# EAGLE design Bell (EAGLE 7.5.0)
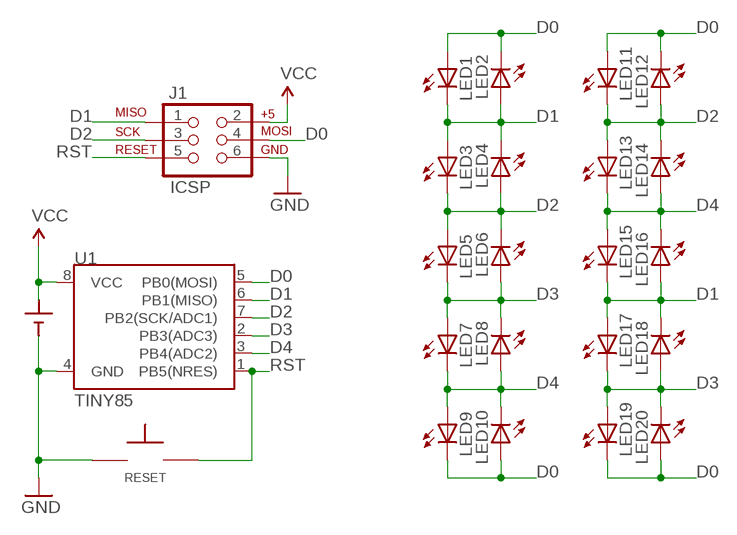
[diagram p0: schematic, sheet 1]

## Parts
BATT  CR2032  BATTCR2032_THRU  [CR2032-THRU]
J1  ICSP  AVR_SPI_PRG_6LABELED  [2X3-NS]
LED1  LED5MM  [LED5MM]
LED2  LED5MM  [LED5MM]
LED3  LED5MM  [LED5MM]
LED4  LED5MM  [LED5MM]
LED5  LED5MM  [LED5MM]
LED6  LED5MM  [LED5MM]
LED7  LED5MM  [LED5MM]
LED8  LED5MM  [LED5MM]
LED9  LED5MM  [LED5MM]
LED10  LED5MM  [LED5MM]
LED11  LED5MM  [LED5MM]
LED12  LED5MM  [LED5MM]
LED13  LED5MM  [LED5MM]
LED14  LED5MM  [LED5MM]
LED15  LED5MM  [LED5MM]
LED16  LED5MM  [LED5MM]
LED17  LED5MM  [LED5MM]
LED18  LED5MM  [LED5MM]
LED19  LED5MM  [LED5MM]
LED20  LED5MM  [LED5MM]
RESET  TAC_SPST_NO  [TAC_SPST_NO]
U1  TINY85  ATTINY45TINY85-20-DIP  [DIP08]

## Nets
D0: J1.4(MOSI) LED1.A LED2.K(C) LED9.K(C) LED10.A LED11.A LED12.K(C) LED19.K(C) LED20.A U1.5(PB0(MOSI))
D1: J1.1(MISO) LED1.K(C) LED2.A LED3.A LED4.K(C) LED15.K(C) LED16.A LED17.A LED18.K(C) U1.6(PB1(MISO))
D2: J1.3(SCK) LED3.K(C) LED4.A LED5.A LED6.K(C) LED11.K(C) LED12.A LED13.A LED14.K(C) U1.7(PB2(SCK/ADC1))
D3: LED5.K(C) LED6.A LED7.A LED8.K(C) LED17.K(C) LED18.A LED19.A LED20.K(C) U1.2(PB3(ADC3))
D4: LED7.K(C) LED8.A LED9.A LED10.K(C) LED13.K(C) LED14.A LED15.A LED16.K(C) U1.3(PB4(ADC2))
GND: BATT.- J1.6(GND) RESET.P$1 U1.4(GND)
RST: J1.5(RST) RESET.P$2 U1.1(PB5(NRES))
VCC: BATT.+1(+) J1.2(V+) U1.8(VCC)

## Library data of the parts
BATT = battery:BATT
J1 = barbary_enterprises:AVR_SPI_PRG_6: AVR ISP 6 Pin This is the reduced ISP connector for AVR programming. Common on Arduino. This footprint will take up less PCB space and can be used with a 10-pin to 6-pin adapter such as SKU: BOB-08508
LED1-LED20 = barbary_enterprises:LED: LEDs Standard schematic elements and footprints for 5mm, 3mm, 1206, and 0603 sized LEDs. 5mm - Spark Fun Electronics SKU : COM-00529 (and others)
RESET = barbary_enterprises:TAC_SPST_NO: 3,5 mm Tact Switches C&K PTS635 Series * Digi-Key Part Number: CKN9102-ND
U1 = SparkFun-DigitalIC:ATTINY45: Atmel 8-pin 2/4/8kB flash uC; PROD_ID: IC-09445; VALUE: TINY85-20-DIP

## Board
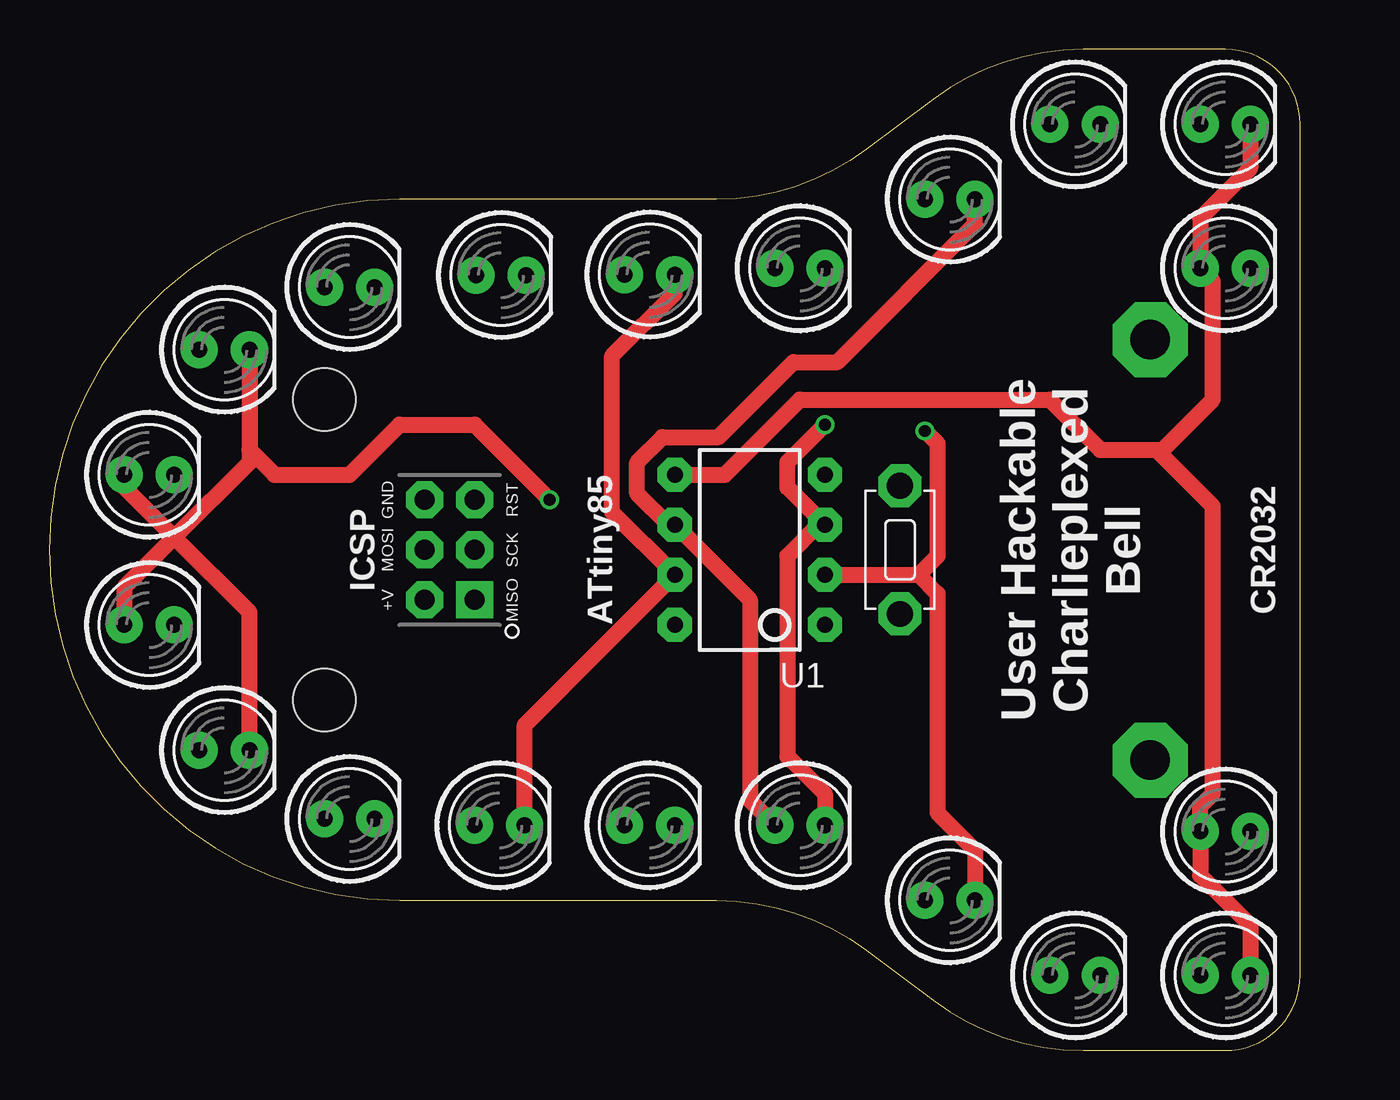
[diagram p1: board, top side]
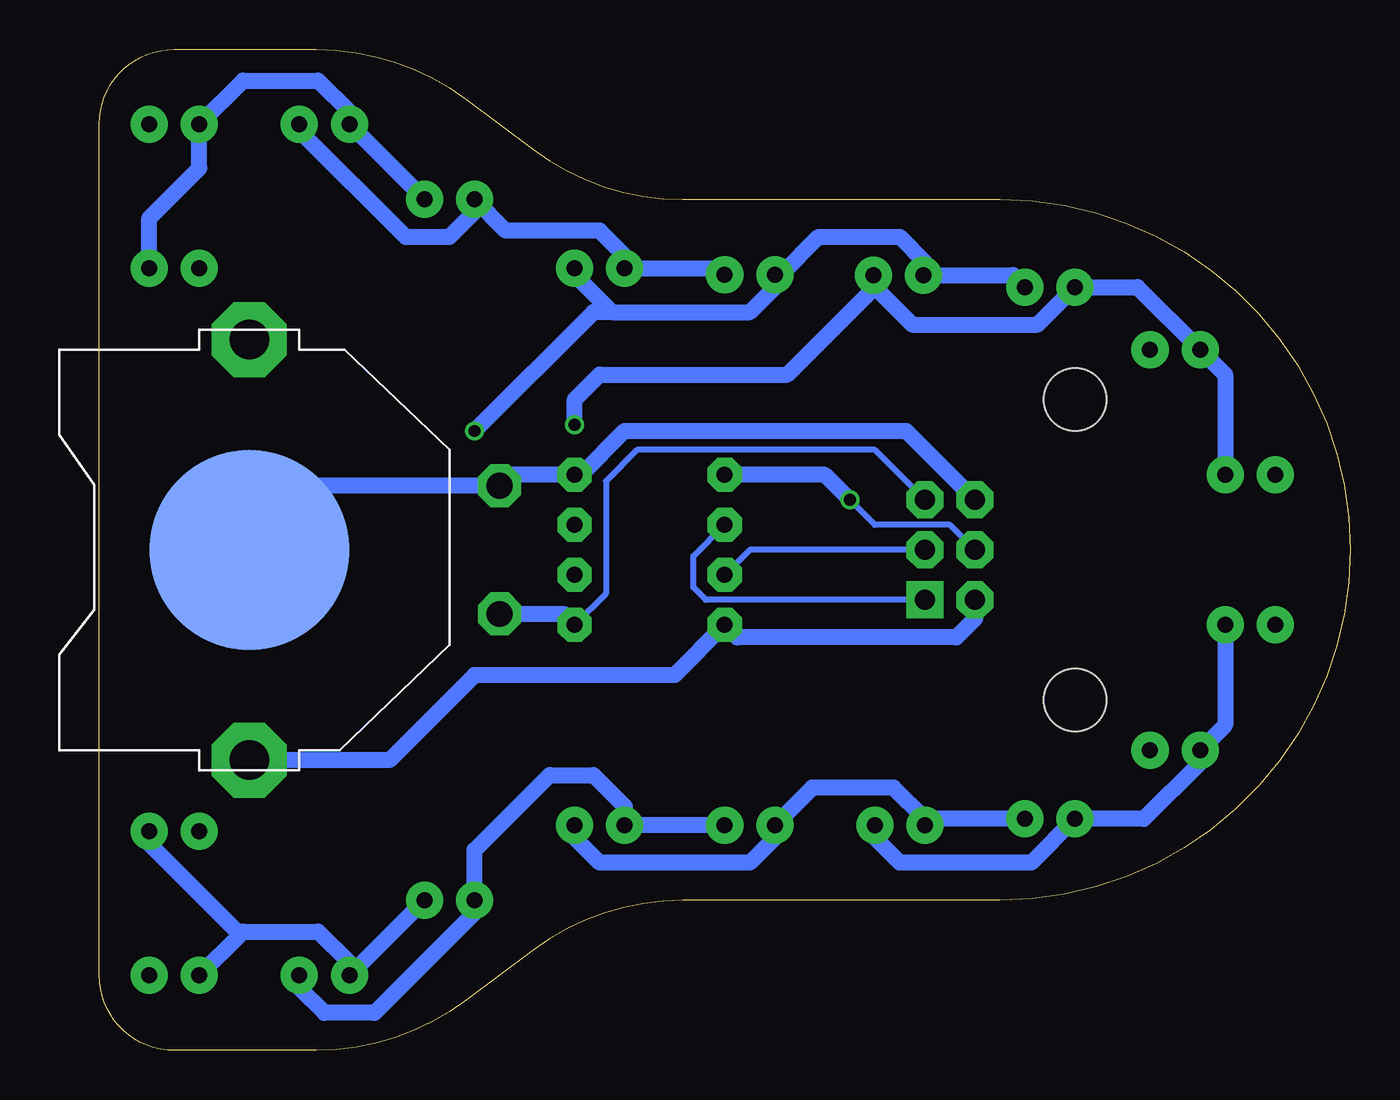
[diagram p2: board, bottom side, seen from below]

Size 63.5 x 50.8 mm. Coordinates in mm from the lower left corner, seen from the top.
Outline: 0,25.4 arc90 17.78,7.62 33.87,7.62 arc-37 41.49,5.08 44.87,2.54 arc37 52.49,0 59.68,0 arc90 63.5,3.82 63.5,46.99 arc90 59.69,50.8 52.49,50.8 arc37 44.87,48.26 41.49,45.72 arc-37 33.87,43.18 17.78,43.18 arc90 0,25.4
Copper layers (1*16): Top 0.0356mm / dielectric 1.5011mm / Bottom 0.0356mm
Design rules "LaenPCBOrder": minimum track width 6mil, minimum drill 13mil, track to track 6mil, track to pad 6mil, pad to pad 6mil, via to via 6mil, smd to smd 6mil, copper to edge 15mil, drill to drill 6mil, minimum pad ring 7mil, minimum via ring 7mil, stop-mask expansion 3mil, vias tented up to drill 0mil, thermal gap 10mil
Holes 3.17 mm at 13.97,33.02 13.97,17.78

### Footprints (pad centres in the part's own frame; a part is rotated, then mirrored left to right if it is on the bottom)
CR2032-THRU = drill 2 pad 3.81 octagon: +1 -10.668,0; +2 10.668,0 | smd 10.16 x 10.16: - 0,0
2X3-NS = drill 1.016 pad 1.88 square: 1 -2.54,-1.27 | drill 1.016 pad 1.88 octagon: 2 -2.54,1.27; 3 0,-1.27; 4 0,1.27; 5 2.54,-1.27; 6 2.54,1.27
LED5MM = drill 0.813 pad 1.88: A -1.27,0; K 1.27,0
TAC_SPST_NO = drill 1.3 pad 2.184 octagon: P$1 -3.251,0; P$2 3.251,0
DIP08 = drill 0.813 pad 1.727 octagon: 1 -3.81,-3.81; 2 -1.27,-3.81; 3 1.27,-3.81; 4 3.81,-3.81; 5 3.81,3.81; 6 1.27,3.81; 7 -1.27,3.81; 8 -3.81,3.81

### Placement (x,y rotation side)
BATT  55.88,25.4 90 bottom
J1  20.32,25.4 90 top
LED1  59.69,39.69 0 top
LED2  59.69,46.99 0 top
LED3  52.07,46.99 0 top
LED4  45.72,43.18 0 top
LED5  38.1,39.69 0 top
LED6  30.48,39.37 0 top
LED7  22.94,39.34 0 top
LED8  15.24,38.73 0 top
LED9  8.89,35.56 0 top
LED10  5.08,29.21 0 top
LED11  5.08,21.59 0 top
LED12  8.89,15.24 0 top
LED13  15.24,11.75 0 top
LED14  22.86,11.43 0 top
LED15  30.48,11.43 0 top
LED16  38.1,11.43 0 top
LED17  45.72,7.62 0 top
LED18  52.07,3.81 0 top
LED19  59.69,3.81 0 top
LED20  59.69,11.11 0 top
RESET  43.18,25.4 270 top
U1  35.56,25.4 90 top

### Tracks (layer width: path | path; a pad name or v marks a point on that pad's centre or on a via)
D0  (via drill 0.6)
  Top 0.813: LED2.K 60.96,44.77 58.42,42.23 LED1.A 59.05,39.05 59.05,33.02 56.52,30.48 56.2,30.48 | 6.35,26.04 10.16,29.84 10.16,30.48 | 6.35,26.04 3.81,23.5 LED11.A | LED10.A 3.81,28.57 6.35,26.04 | LED12.K 10.16,22.23 6.35,26.04 | LED19.K 60.96,6.35 58.42,8.89 LED20.A 58.42,12.38 59.05,13.02 59.05,27.62 56.2,30.48 | U1.5 34.29,29.21 38.1,33.02 50.8,33.02 53.34,30.48 56.2,30.48 | LED9.K 10.16,30.48 | 10.16,30.48 11.43,29.21 15.24,29.21 17.78,31.75 21.59,31.75 v25.4,27.94
  Bottom 0.305: J1.4 20.32,26.67 24.13,26.67 v25.4,27.94
  Bottom 0.813: v25.4,27.94 26.67,29.21 U1.5
D1
  Top 0.813: LED4.K 46.99,41.91 40.01,34.92 37.78,34.92 33.97,31.11 31.11,31.11 29.84,29.84 29.84,28.26 31.43,26.67 U1.6 35.56,22.86 35.56,12.7 LED16.A
  Bottom 0.305: J1.1 32.7,22.86 33.34,23.5 33.34,25.08 U1.6
  Bottom 0.813: LED1.K 60.96,42.23 58.42,44.77 LED2.A 56.2,49.21 52.39,49.21 50.8,47.62 LED3.A LED4.K | LED15.K LED16.A 36.83,12.38 38.42,13.97 40.64,13.97 44.45,10.16 LED17.A 44.45,6.99 49.53,1.91 52.07,1.91 53.34,3.17 LED18.K
D2
  Top 0.813: LED6.K 31.75,38.42 28.57,35.24 28.57,27.3 U1.7 24.13,16.51 LED14.K
  Bottom 0.305: J1.3 30.48,25.4 U1.7
  Bottom 0.813: LED3.K 53.34,46.67 47.94,41.27 45.72,41.27 44.45,42.55 LED4.A 42.86,41.59 38.1,41.59 36.83,40.32 LED5.A 32.07,39.69 LED6.K | LED11.K 6.35,16.51 LED12.A 7.62,14.61 10.48,11.75 LED13.A 16.19,9.53 22.86,9.53 24.13,10.79 LED14.K
D3  (via drill 0.6)
  Top 0.813: U1.2 44.13,24.13 | 44.13,24.13 45.09,23.18 45.09,12.06 46.99,10.16 LED17.K | v44.45,31.43 45.09,30.8 45.09,25.08 44.13,24.13
  Bottom 0.813: LED5.K 39.37,39.37 37.47,37.47 | 37.47,37.47 30.48,37.47 29.21,38.73 LED6.A 28.89,39.37 26.99,41.27 22.86,41.27 21.59,40.01 21.59,39.42 LED7.A 17.12,39.34 LED8.K | LED17.K LED18.A 50.8,4.45 52.39,6.03 56.2,6.03 56.36,5.87 | LED19.A 56.36,5.87 | LED20.K 60.96,10.48 56.36,5.87 | 37.47,37.47 38.42,37.47 v44.45,31.43
D4  (via drill 0.6)
  Top 0.813: LED16.K 39.37,13.02 37.47,14.92 37.47,25.08 39.05,26.67 U1.3 37.47,28.57 37.47,29.84 v39.37,31.75
  Bottom 0.813: LED7.K 24.21,38.81 24.13,38.73 | 24.13,38.73 22.23,36.83 15.88,36.83 LED8.A 10.79,38.73 LED9.A 6.35,34.29 LED10.K | LED13.K 21.27,11.75 LED14.A 21.59,11.75 23.18,13.34 27.3,13.34 LED15.A 29.21,10.79 30.48,9.53 38.1,9.53 39.37,10.79 LED16.K | v39.37,31.75 39.37,33.02 38.1,34.29 28.57,34.29 24.13,38.73
GND
  Bottom 0.813: BATT.- 52.63,28.65 RESET.P$1 42.62,29.21 U1.4 39.05,29.21 36.83,31.43 22.54,31.43 J1.6
RST
  Bottom 0.305: J1.5 24.13,30.48 36.2,30.48 37.78,28.89 37.78,23.18 U1.1
  Bottom 0.813: RESET.P$2 39.93,22.15 U1.1
VCC
  Bottom 0.813: BATT.+1 48.77,14.73 44.45,19.05 34.29,19.05 U1.8 31.11,20.95 20,20.95 19.05,21.91 J1.2

### Text on the board
tPlace: ICSP | ATtiny85 | User Hackable / Charlieplexed / Bell | CR2032